# EAGLE schematic PCB (EAGLE 9.6.2)
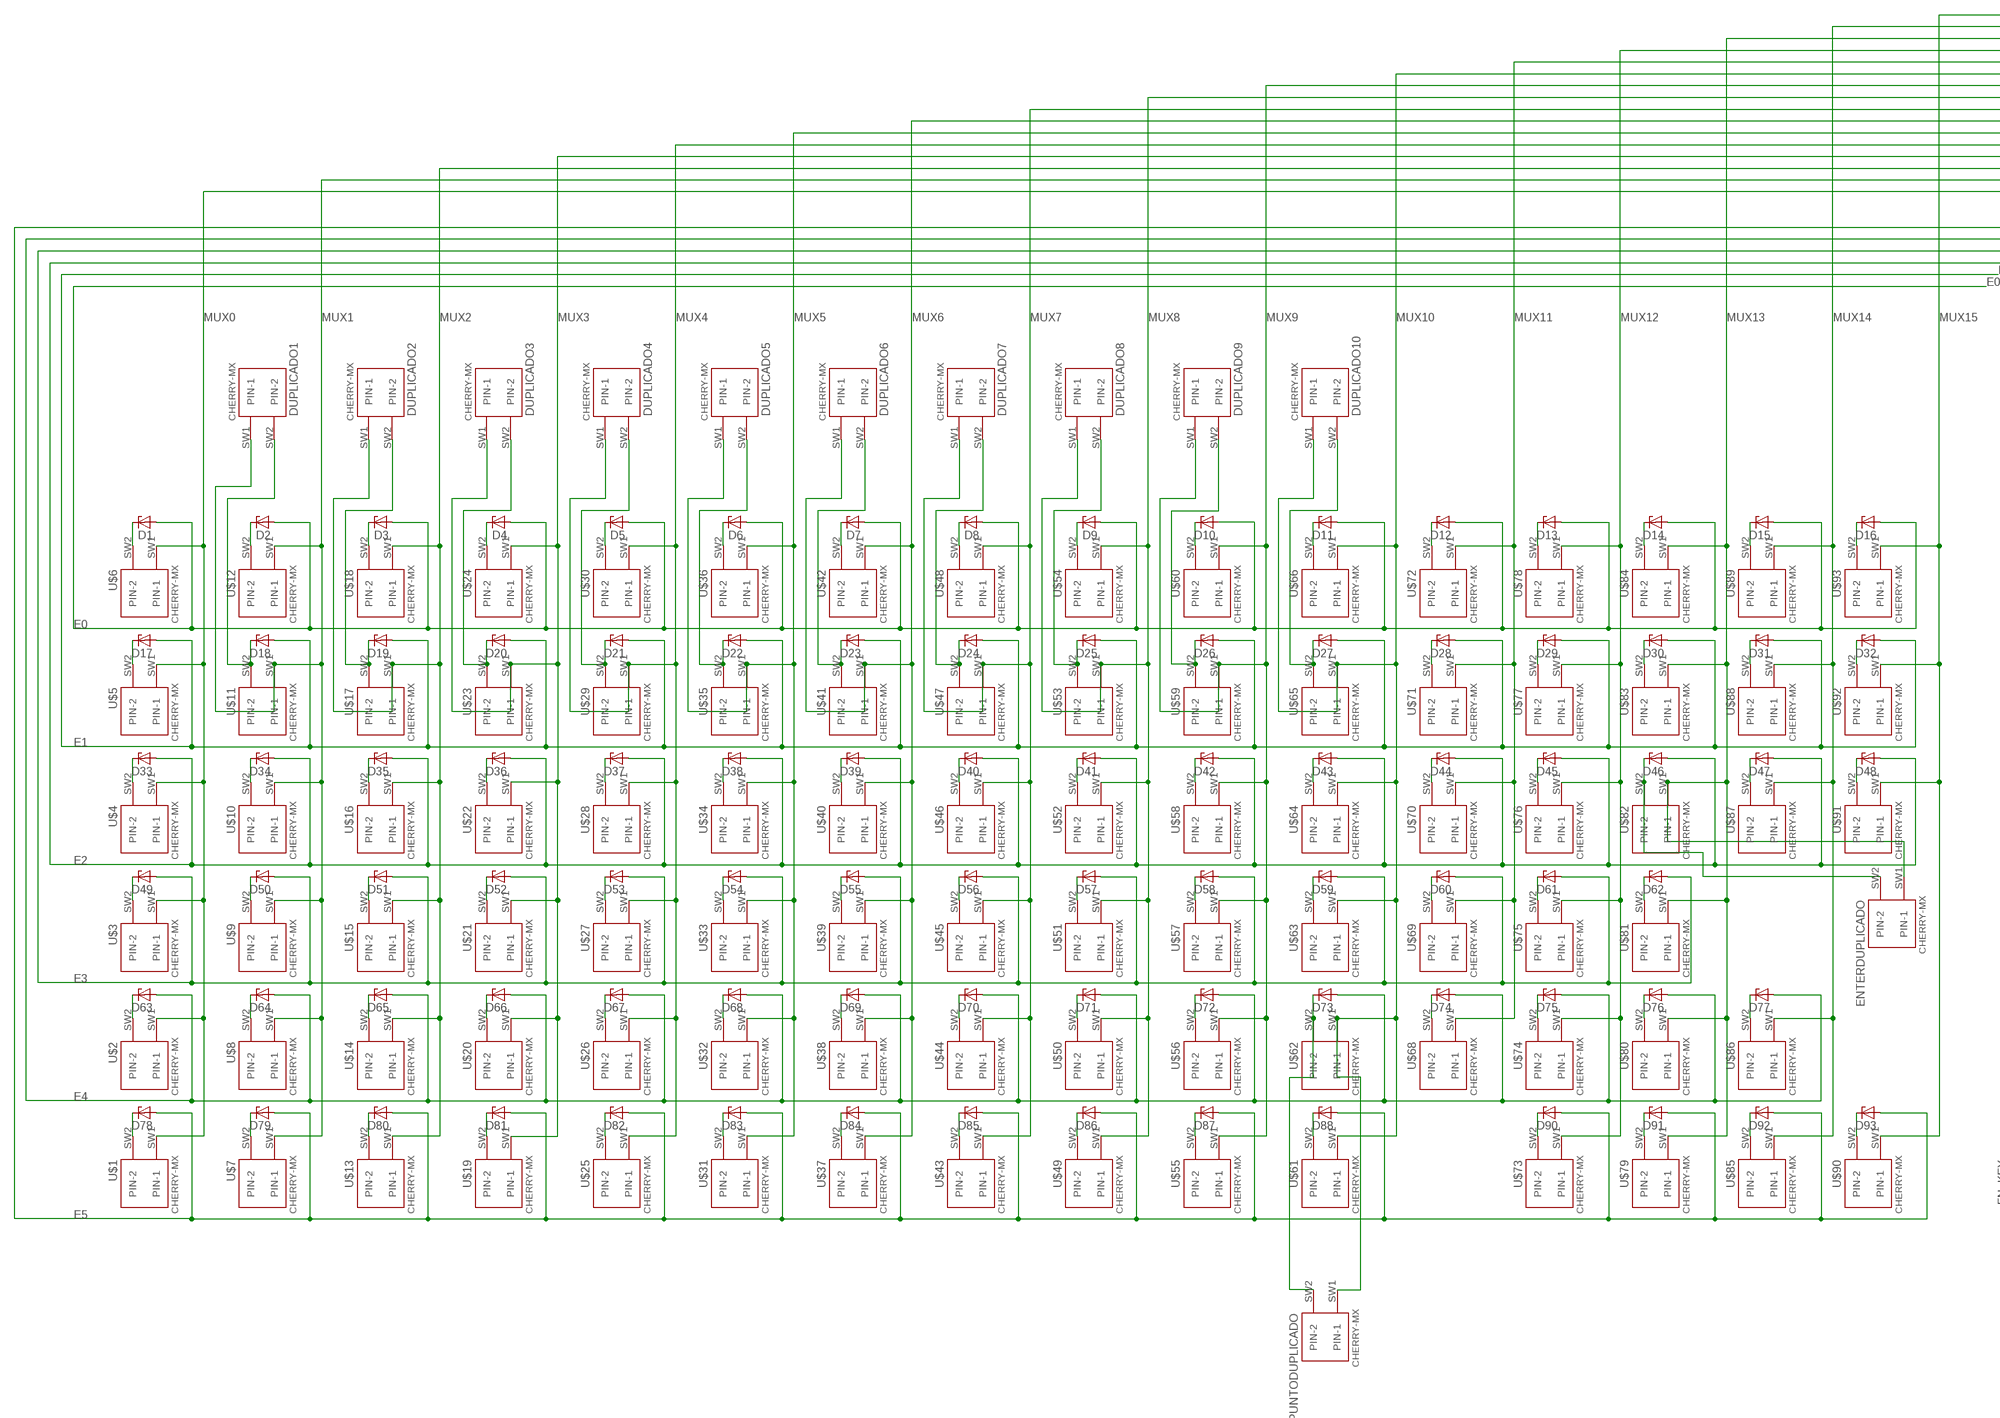
[diagram p0: schematic, sheet 1, part 1 of 2]
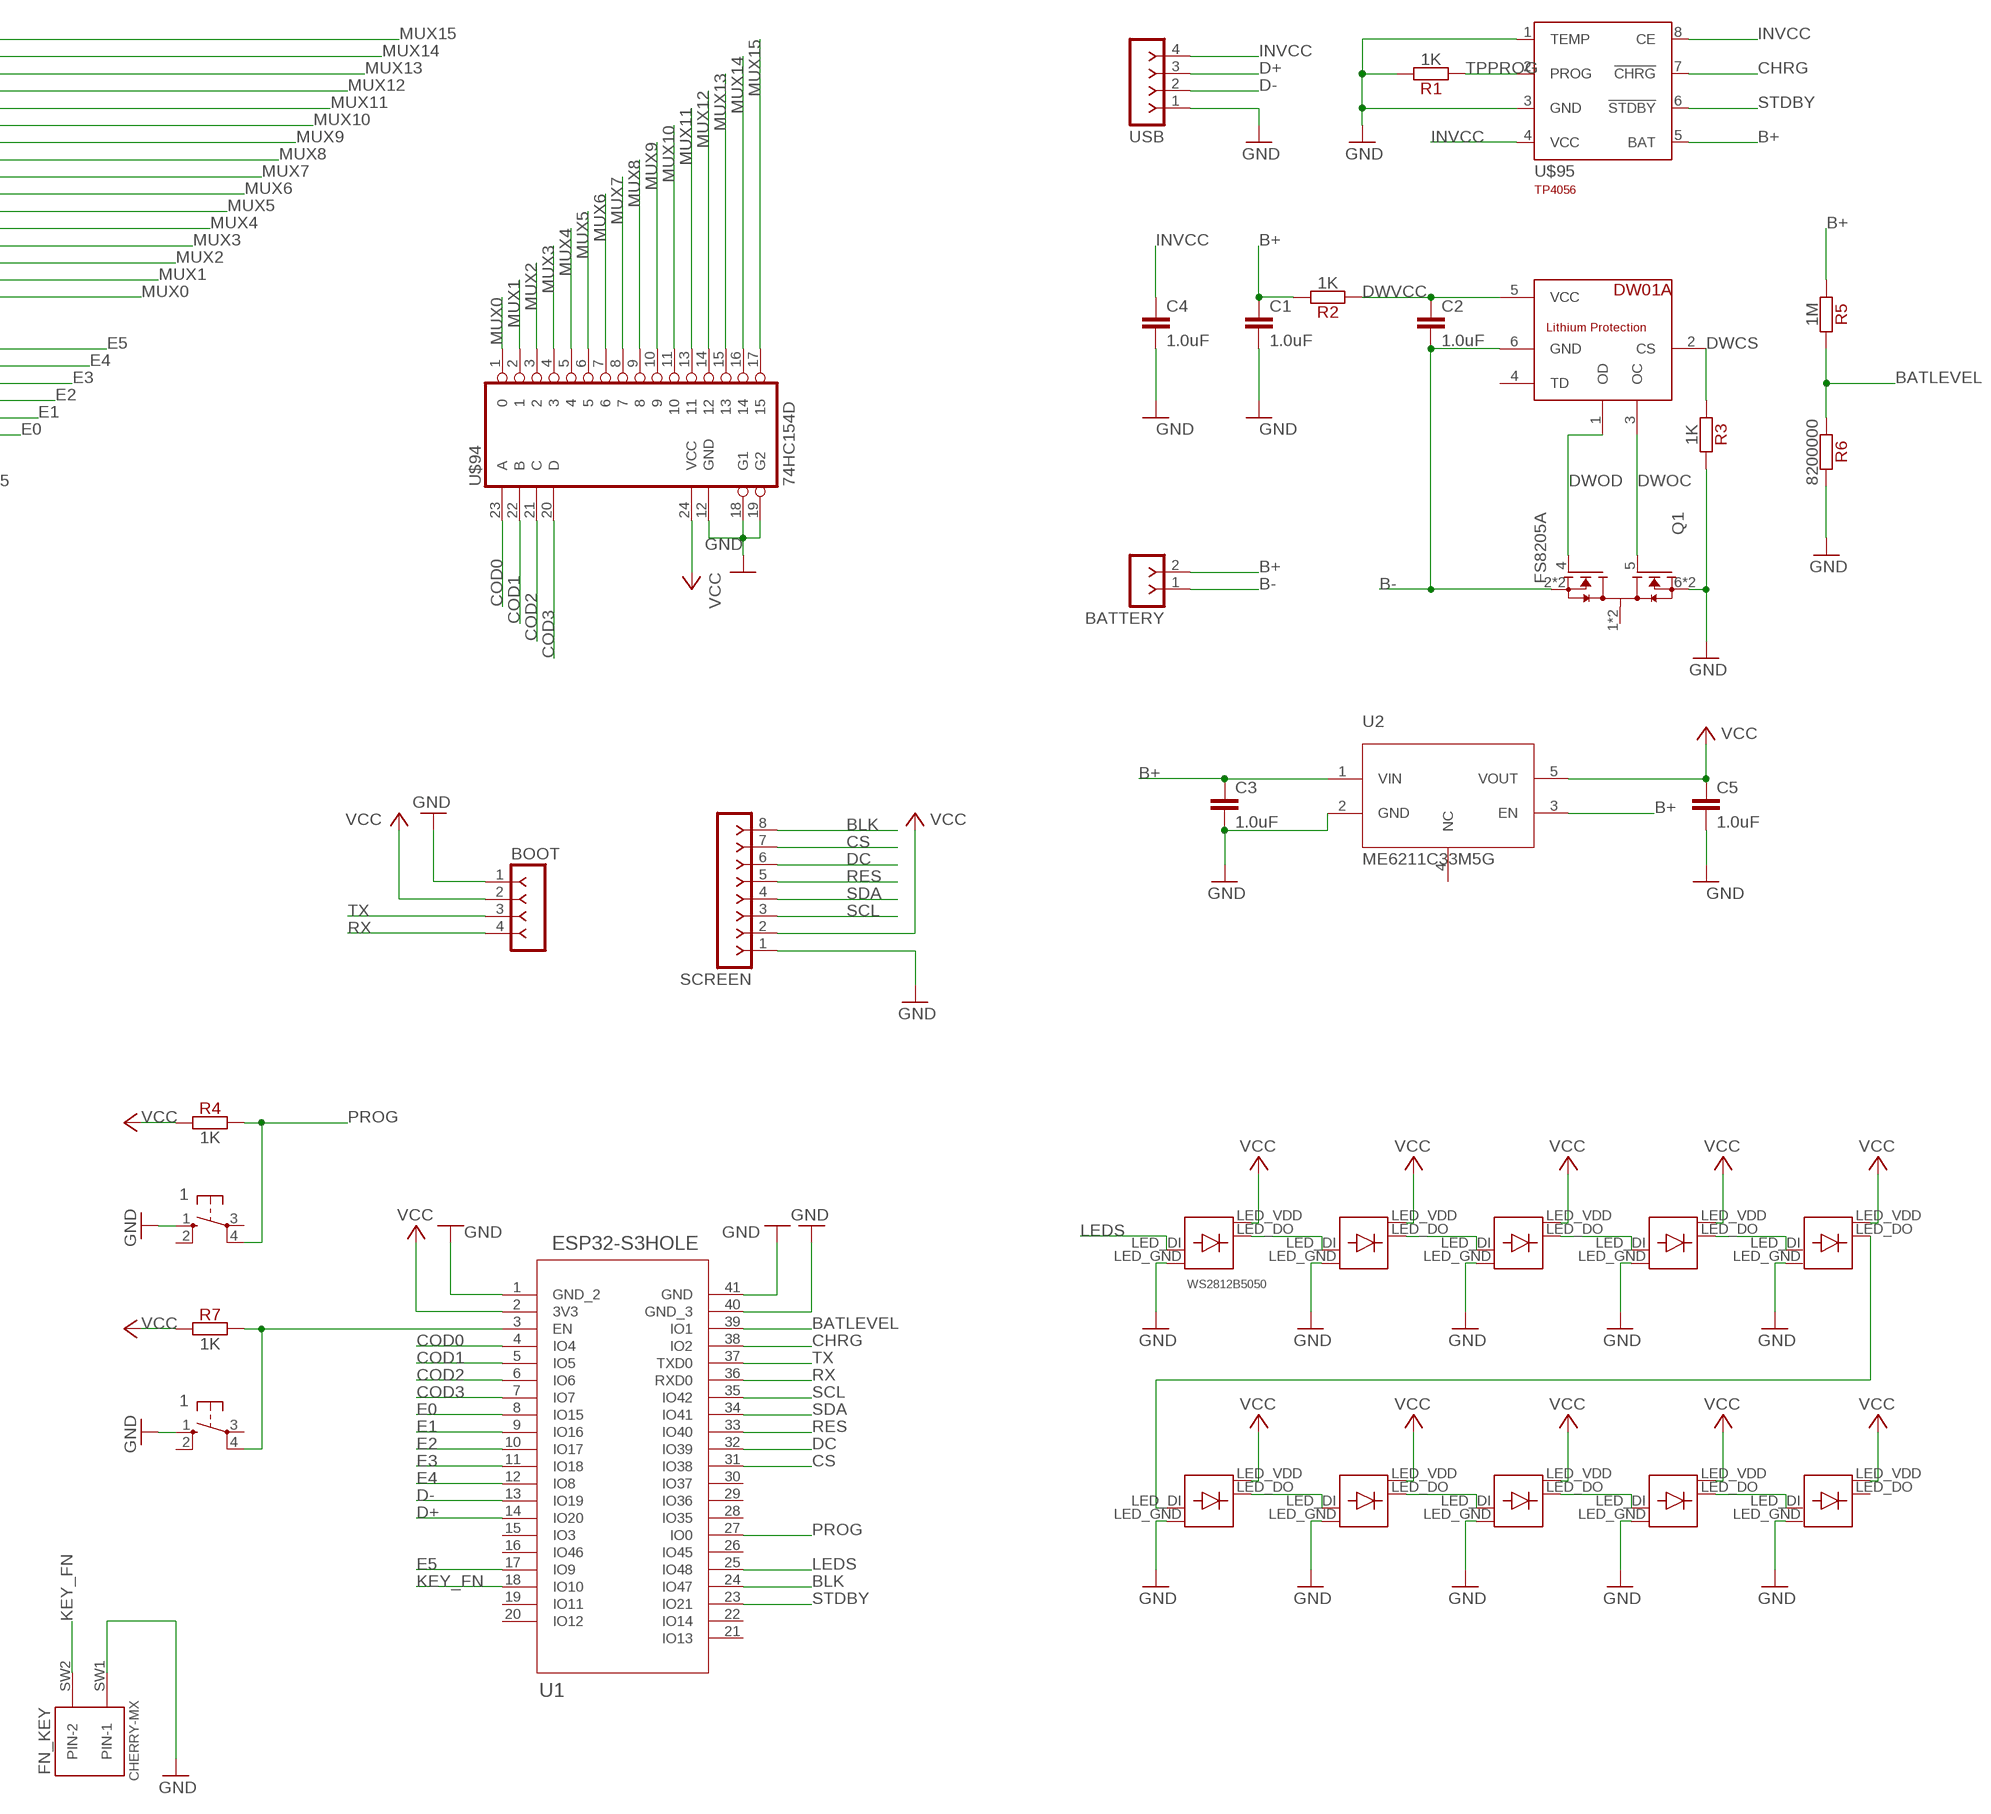
[diagram p1: schematic, sheet 1, part 2 of 2]

## Parts
BATTERY  F-1X02-SIP-100-40  [SIP-100-02-40]
BOOT  BOOT  F-1X04-SIP-100-32  [SIP-100-04-32]
BUTTON  1  10-XX  [B3F-10XX]
BUTTON1  1  10-XX  [B3F-10XX]
C1  1.0uF  1.0UF-1206-50V-10%  [1206]
C2  1.0uF  1.0UF-1206-50V-10%  [1206]
C3  1.0uF  1.0UF-1206-50V-10%  [1206]
C4  1.0uF  1.0UF-1206-50V-10%  [1206]
C5  1.0uF  1.0UF-1206-50V-10%  [1206]
D1  ZENER-DIODE-SOD123  [SOD123FL]
D2  ZENER-DIODE-SOD123  [SOD123FL]
D3  ZENER-DIODE-SOD123  [SOD123FL]
D4  ZENER-DIODE-SOD123  [SOD123FL]
D5  ZENER-DIODE-SOD123  [SOD123FL]
D6  ZENER-DIODE-SOD123  [SOD123FL]
D7  ZENER-DIODE-SOD123  [SOD123FL]
D8  ZENER-DIODE-SOD123  [SOD123FL]
D9  ZENER-DIODE-SOD123  [SOD123FL]
D10  ZENER-DIODE-SOD123  [SOD123FL]
D11  ZENER-DIODE-SOD123  [SOD123FL]
D12  ZENER-DIODE-SOD123  [SOD123FL]
D13  ZENER-DIODE-SOD123  [SOD123FL]
D14  ZENER-DIODE-SOD123  [SOD123FL]
D15  ZENER-DIODE-SOD123  [SOD123FL]
D16  ZENER-DIODE-SOD123  [SOD123FL]
D17  ZENER-DIODE-SOD123  [SOD123FL]
D18  ZENER-DIODE-SOD123  [SOD123FL]
D19  ZENER-DIODE-SOD123  [SOD123FL]
D20  ZENER-DIODE-SOD123  [SOD123FL]
D21  ZENER-DIODE-SOD123  [SOD123FL]
D22  ZENER-DIODE-SOD123  [SOD123FL]
D23  ZENER-DIODE-SOD123  [SOD123FL]
D24  ZENER-DIODE-SOD123  [SOD123FL]
D25  ZENER-DIODE-SOD123  [SOD123FL]
D26  ZENER-DIODE-SOD123  [SOD123FL]
D27  ZENER-DIODE-SOD123  [SOD123FL]
D28  ZENER-DIODE-SOD123  [SOD123FL]
D29  ZENER-DIODE-SOD123  [SOD123FL]
D30  ZENER-DIODE-SOD123  [SOD123FL]
D31  ZENER-DIODE-SOD123  [SOD123FL]
D32  ZENER-DIODE-SOD123  [SOD123FL]
D33  ZENER-DIODE-SOD123  [SOD123FL]
D34  ZENER-DIODE-SOD123  [SOD123FL]
D35  ZENER-DIODE-SOD123  [SOD123FL]
D36  ZENER-DIODE-SOD123  [SOD123FL]
D37  ZENER-DIODE-SOD123  [SOD123FL]
D38  ZENER-DIODE-SOD123  [SOD123FL]
D39  ZENER-DIODE-SOD123  [SOD123FL]
D40  ZENER-DIODE-SOD123  [SOD123FL]
D41  ZENER-DIODE-SOD123  [SOD123FL]
D42  ZENER-DIODE-SOD123  [SOD123FL]
D43  ZENER-DIODE-SOD123  [SOD123FL]
D44  ZENER-DIODE-SOD123  [SOD123FL]
D45  ZENER-DIODE-SOD123  [SOD123FL]
D46  ZENER-DIODE-SOD123  [SOD123FL]
D47  ZENER-DIODE-SOD123  [SOD123FL]
D48  ZENER-DIODE-SOD123  [SOD123FL]
D49  ZENER-DIODE-SOD123  [SOD123FL]
D50  ZENER-DIODE-SOD123  [SOD123FL]
D51  ZENER-DIODE-SOD123  [SOD123FL]
D52  ZENER-DIODE-SOD123  [SOD123FL]
D53  ZENER-DIODE-SOD123  [SOD123FL]
D54  ZENER-DIODE-SOD123  [SOD123FL]
D55  ZENER-DIODE-SOD123  [SOD123FL]
D56  ZENER-DIODE-SOD123  [SOD123FL]
D57  ZENER-DIODE-SOD123  [SOD123FL]
D58  ZENER-DIODE-SOD123  [SOD123FL]
D59  ZENER-DIODE-SOD123  [SOD123FL]
D60  ZENER-DIODE-SOD123  [SOD123FL]
D61  ZENER-DIODE-SOD123  [SOD123FL]
D62  ZENER-DIODE-SOD123  [SOD123FL]
D63  ZENER-DIODE-SOD123  [SOD123FL]
D64  ZENER-DIODE-SOD123  [SOD123FL]
D65  ZENER-DIODE-SOD123  [SOD123FL]
D66  ZENER-DIODE-SOD123  [SOD123FL]
D67  ZENER-DIODE-SOD123  [SOD123FL]
D68  ZENER-DIODE-SOD123  [SOD123FL]
D69  ZENER-DIODE-SOD123  [SOD123FL]
D70  ZENER-DIODE-SOD123  [SOD123FL]
D71  ZENER-DIODE-SOD123  [SOD123FL]
D72  ZENER-DIODE-SOD123  [SOD123FL]
D73  ZENER-DIODE-SOD123  [SOD123FL]
D74  ZENER-DIODE-SOD123  [SOD123FL]
D75  ZENER-DIODE-SOD123  [SOD123FL]
D76  ZENER-DIODE-SOD123  [SOD123FL]
D77  ZENER-DIODE-SOD123  [SOD123FL]
D78  ZENER-DIODE-SOD123  [SOD123FL]
D79  ZENER-DIODE-SOD123  [SOD123FL]
D80  ZENER-DIODE-SOD123  [SOD123FL]
D81  ZENER-DIODE-SOD123  [SOD123FL]
D82  ZENER-DIODE-SOD123  [SOD123FL]
D83  ZENER-DIODE-SOD123  [SOD123FL]
D84  ZENER-DIODE-SOD123  [SOD123FL]
D85  ZENER-DIODE-SOD123  [SOD123FL]
D86  ZENER-DIODE-SOD123  [SOD123FL]
D87  ZENER-DIODE-SOD123  [SOD123FL]
D88  ZENER-DIODE-SOD123  [SOD123FL]
D90  ZENER-DIODE-SOD123  [SOD123FL]
D91  ZENER-DIODE-SOD123  [SOD123FL]
D92  ZENER-DIODE-SOD123  [SOD123FL]
D93  ZENER-DIODE-SOD123  [SOD123FL]
DUPLICADO1  CHERRY-MX  [CHERRY-MX]
DUPLICADO2  CHERRY-MX  [CHERRY-MX]
DUPLICADO3  CHERRY-MX  [CHERRY-MX]
DUPLICADO4  CHERRY-MX  [CHERRY-MX]
DUPLICADO5  CHERRY-MX  [CHERRY-MX]
DUPLICADO6  CHERRY-MX  [CHERRY-MX]
DUPLICADO7  CHERRY-MX  [CHERRY-MX]
DUPLICADO8  CHERRY-MX  [CHERRY-MX]
DUPLICADO9  CHERRY-MX  [CHERRY-MX]
DUPLICADO10  CHERRY-MX  [CHERRY-MX]
ENTERDUPLICADO  CHERRY-MX  [CHERRY-MX]
FN_KEY  CHERRY-MX  [CHERRY-MX]
PUNTODUPLICADO  CHERRY-MX  [CHERRY-MX]
Q1  FS8205A  [SOP65P640X120-8N]
R1  1K  [R-0805]
R2  1K  [R-0805]
R3  1K  [R-0805]
R4  1K  [R-0805]
R5  1M  1K  [R-0805]
R6  8200000  1K  [R-0805]
R7  1K  [R-0805]
SCREEN  F-1X08-SIP-100-40  [SIP-100-08-40]
U1  ESP32-S3HOLE  [ESP32-S3HOLE]
U2  ME6211C33M5G  [ME6211C33M5G]
U$1  CHERRY-MX  [CHERRY-MX]
U$2  CHERRY-MX  [CHERRY-MX]
U$3  CHERRY-MX  [CHERRY-MX]
U$4  CHERRY-MX  [CHERRY-MX]
U$5  CHERRY-MX  [CHERRY-MX]
U$6  CHERRY-MX  [CHERRY-MX]
U$7  CHERRY-MX  [CHERRY-MX]
U$8  CHERRY-MX  [CHERRY-MX]
U$9  CHERRY-MX  [CHERRY-MX]
U$10  CHERRY-MX  [CHERRY-MX]
U$11  CHERRY-MX  [CHERRY-MX]
U$12  CHERRY-MX  [CHERRY-MX]
U$13  CHERRY-MX  [CHERRY-MX]
U$14  CHERRY-MX  [CHERRY-MX]
U$15  CHERRY-MX  [CHERRY-MX]
U$16  CHERRY-MX  [CHERRY-MX]
U$17  CHERRY-MX  [CHERRY-MX]
U$18  CHERRY-MX  [CHERRY-MX]
U$19  CHERRY-MX  [CHERRY-MX]
U$20  CHERRY-MX  [CHERRY-MX]
U$21  CHERRY-MX  [CHERRY-MX]
U$22  CHERRY-MX  [CHERRY-MX]
U$23  CHERRY-MX  [CHERRY-MX]
U$24  CHERRY-MX  [CHERRY-MX]
U$25  CHERRY-MX  [CHERRY-MX]
U$26  CHERRY-MX  [CHERRY-MX]
U$27  CHERRY-MX  [CHERRY-MX]
U$28  CHERRY-MX  [CHERRY-MX]
U$29  CHERRY-MX  [CHERRY-MX]
U$30  CHERRY-MX  [CHERRY-MX]
U$31  CHERRY-MX  [CHERRY-MX]
U$32  CHERRY-MX  [CHERRY-MX]
U$33  CHERRY-MX  [CHERRY-MX]
U$34  CHERRY-MX  [CHERRY-MX]
U$35  CHERRY-MX  [CHERRY-MX]
U$36  CHERRY-MX  [CHERRY-MX]
U$37  CHERRY-MX  [CHERRY-MX]
U$38  CHERRY-MX  [CHERRY-MX]
U$39  CHERRY-MX  [CHERRY-MX]
U$40  CHERRY-MX  [CHERRY-MX]
U$41  CHERRY-MX  [CHERRY-MX]
U$42  CHERRY-MX  [CHERRY-MX]
U$43  CHERRY-MX  [CHERRY-MX]
U$44  CHERRY-MX  [CHERRY-MX]
U$45  CHERRY-MX  [CHERRY-MX]
U$46  CHERRY-MX  [CHERRY-MX]
U$47  CHERRY-MX  [CHERRY-MX]
U$48  CHERRY-MX  [CHERRY-MX]
U$49  CHERRY-MX  [CHERRY-MX]
U$50  CHERRY-MX  [CHERRY-MX]
U$51  CHERRY-MX  [CHERRY-MX]
U$52  CHERRY-MX  [CHERRY-MX]
U$53  CHERRY-MX  [CHERRY-MX]
U$54  CHERRY-MX  [CHERRY-MX]
U$55  CHERRY-MX  [CHERRY-MX]
U$56  CHERRY-MX  [CHERRY-MX]
U$57  CHERRY-MX  [CHERRY-MX]
U$58  CHERRY-MX  [CHERRY-MX]
U$59  CHERRY-MX  [CHERRY-MX]
U$60  CHERRY-MX  [CHERRY-MX]
U$61  CHERRY-MX  [CHERRY-MX]
U$62  CHERRY-MX  [CHERRY-MX]
U$63  CHERRY-MX  [CHERRY-MX]
U$64  CHERRY-MX  [CHERRY-MX]
U$65  CHERRY-MX  [CHERRY-MX]
U$66  CHERRY-MX  [CHERRY-MX]
U$67  WS2812B5050  [WS2812B5050]
U$68  CHERRY-MX  [CHERRY-MX]
U$69  CHERRY-MX  [CHERRY-MX]
U$70  CHERRY-MX  [CHERRY-MX]
U$71  CHERRY-MX  [CHERRY-MX]
U$72  CHERRY-MX  [CHERRY-MX]
U$73  CHERRY-MX  [CHERRY-MX]
U$74  CHERRY-MX  [CHERRY-MX]
U$75  CHERRY-MX  [CHERRY-MX]
U$76  CHERRY-MX  [CHERRY-MX]
U$77  CHERRY-MX  [CHERRY-MX]
U$78  CHERRY-MX  [CHERRY-MX]
U$79  CHERRY-MX  [CHERRY-MX]
U$80  CHERRY-MX  [CHERRY-MX]
U$81  CHERRY-MX  [CHERRY-MX]
U$82  CHERRY-MX  [CHERRY-MX]
U$83  CHERRY-MX  [CHERRY-MX]
U$84  CHERRY-MX  [CHERRY-MX]
U$85  CHERRY-MX  [CHERRY-MX]
U$86  CHERRY-MX  [CHERRY-MX]
U$87  CHERRY-MX  [CHERRY-MX]
U$88  CHERRY-MX  [CHERRY-MX]
U$89  CHERRY-MX  [CHERRY-MX]
U$90  CHERRY-MX  [CHERRY-MX]
U$91  CHERRY-MX  [CHERRY-MX]
U$92  CHERRY-MX  [CHERRY-MX]
U$93  CHERRY-MX  [CHERRY-MX]
U$94  74HC154D  [74HC154D]
U$95  TP4056  [SOT23-8]
U$96  DW01A  [SOT23-6]
U$97  WS2812B5050  [WS2812B5050]
U$98  WS2812B5050  [WS2812B5050]
U$99  WS2812B5050  [WS2812B5050]
U$100  WS2812B5050  [WS2812B5050]
U$101  WS2812B5050  [WS2812B5050]
U$102  WS2812B5050  [WS2812B5050]
U$103  WS2812B5050  [WS2812B5050]
U$104  WS2812B5050  [WS2812B5050]
U$105  WS2812B5050  [WS2812B5050]
USB  F-1X04-SIP-100-32  [SIP-100-04-32]

## Nets
B+: BATTERY.2 C1.1 C3.1 R2.2 R5.1 U2.1(VIN) U2.3(EN) U$95.5(BAT)
B-: BATTERY.1 C2.2 Q1.2(S1) Q1.3(S1) U$96.6(GND)
BATLEVEL: R5.2 R6.1 U1.39(IO1)
BLK: SCREEN.8 U1.24(IO47)
CHRG: U1.38(IO2) U$95.7(!CHRG)
COD0: U1.4(IO4) U$94.23(A)
COD1: U1.5(IO5) U$94.22(B)
COD2: U1.6(IO6) U$94.21(C)
COD3: U1.7(IO7) U$94.20(D)
CS: SCREEN.7 U1.31(IO38)
D+: U1.14(IO20) USB.3
D-: U1.13(IO19) USB.2
DC: SCREEN.6 U1.32(IO39)
DWCS: R3.1 U$96.2(CS)
DWOC: Q1.5(G2) U$96.3(OC)
DWOD: Q1.4(G1) U$96.1(OD)
DWVCC: C2.1 R2.1 U$96.5(VCC)
E0: D1.A D2.A D3.A D4.A D5.A D6.A D7.A D8.A D9.A D10.A D11.A D12.A D13.A D14.A D15.A D16.A U1.8(IO15)
E1: D17.A D18.A D19.A D20.A D21.A D22.A D23.A D24.A D25.A D26.A D27.A D28.A D29.A D30.A D31.A D32.A U1.9(IO16)
E2: D33.A D34.A D35.A D36.A D37.A D38.A D39.A D40.A D41.A D42.A D43.A D44.A D45.A D46.A D47.A D48.A U1.10(IO17)
E3: D49.A D50.A D51.A D52.A D53.A D54.A D55.A D56.A D57.A D58.A D59.A D60.A D61.A D62.A U1.11(IO18)
E4: D63.A D64.A D65.A D66.A D67.A D68.A D69.A D70.A D71.A D72.A D73.A D74.A D75.A D76.A D77.A U1.12(IO8)
E5: D78.A D79.A D80.A D81.A D82.A D83.A D84.A D85.A D86.A D87.A D88.A D90.A D91.A D92.A D93.A U1.17(IO9)
EN: BUTTON1.4(P1) R7.2 U1.3(EN)
GND: BOOT.1 BUTTON1.1(S) BUTTON.1(S) C1.2 C3.2 C4.2 C5.2 FN_KEY.SW1(PIN-1) Q1.6(S2) Q1.7(S2) R1.2 R3.2 R6.2 SCREEN.1 U1.1(GND_2) U1.40(GND_3) U1.41(GND) U2.2(GND) U$67.LED_GND U$94.12(GND) U$94.18(G1) U$94.19(G2) U$95.1(TEMP) U$95.3(GND) U$97.LED_GND U$98.LED_GND U$99.LED_GND U$100.LED_GND U$101.LED_GND U$102.LED_GND U$103.LED_GND U$104.LED_GND U$105.LED_GND USB.1
INVCC: C4.1 U$95.4(VCC) U$95.8(CE) USB.4
KEY_FN: FN_KEY.SW2(PIN-2) U1.18(IO10)
LEDS: U1.25(IO48) U$67.LED_DI
MUX0 [Keys]: U$1.SW1(PIN-1) U$2.SW1(PIN-1) U$3.SW1(PIN-1) U$4.SW1(PIN-1) U$5.SW1(PIN-1) U$6.SW1(PIN-1) U$94.1
MUX1 [Keys]: DUPLICADO1.SW1(PIN-1) U$7.SW1(PIN-1) U$8.SW1(PIN-1) U$9.SW1(PIN-1) U$10.SW1(PIN-1) U$11.SW1(PIN-1) U$12.SW1(PIN-1) U$94.2
MUX2 [Keys]: DUPLICADO2.SW1(PIN-1) U$13.SW1(PIN-1) U$14.SW1(PIN-1) U$15.SW1(PIN-1) U$16.SW1(PIN-1) U$17.SW1(PIN-1) U$18.SW1(PIN-1) U$94.3
MUX3 [Keys]: DUPLICADO3.SW1(PIN-1) U$19.SW1(PIN-1) U$20.SW1(PIN-1) U$21.SW1(PIN-1) U$22.SW1(PIN-1) U$23.SW1(PIN-1) U$24.SW1(PIN-1) U$94.4
MUX4 [Keys]: DUPLICADO4.SW1(PIN-1) U$25.SW1(PIN-1) U$26.SW1(PIN-1) U$27.SW1(PIN-1) U$28.SW1(PIN-1) U$29.SW1(PIN-1) U$30.SW1(PIN-1) U$94.5
MUX5 [Keys]: DUPLICADO5.SW1(PIN-1) U$31.SW1(PIN-1) U$32.SW1(PIN-1) U$33.SW1(PIN-1) U$34.SW1(PIN-1) U$35.SW1(PIN-1) U$36.SW1(PIN-1) U$94.6
MUX6 [Keys]: DUPLICADO6.SW1(PIN-1) U$37.SW1(PIN-1) U$38.SW1(PIN-1) U$39.SW1(PIN-1) U$40.SW1(PIN-1) U$41.SW1(PIN-1) U$42.SW1(PIN-1) U$94.7
MUX7 [Keys]: DUPLICADO7.SW1(PIN-1) U$43.SW1(PIN-1) U$44.SW1(PIN-1) U$45.SW1(PIN-1) U$46.SW1(PIN-1) U$47.SW1(PIN-1) U$48.SW1(PIN-1) U$94.8
MUX8 [Keys]: DUPLICADO8.SW1(PIN-1) U$49.SW1(PIN-1) U$50.SW1(PIN-1) U$51.SW1(PIN-1) U$52.SW1(PIN-1) U$53.SW1(PIN-1) U$54.SW1(PIN-1) U$94.9
MUX9 [Keys]: DUPLICADO9.SW1(PIN-1) U$55.SW1(PIN-1) U$56.SW1(PIN-1) U$57.SW1(PIN-1) U$58.SW1(PIN-1) U$59.SW1(PIN-1) U$60.SW1(PIN-1) U$94.10
MUX10 [Keys]: DUPLICADO10.SW1(PIN-1) PUNTODUPLICADO.SW1(PIN-1) U$61.SW1(PIN-1) U$62.SW1(PIN-1) U$63.SW1(PIN-1) U$64.SW1(PIN-1) U$65.SW1(PIN-1) U$66.SW1(PIN-1) U$94.11
MUX11 [Keys]: U$68.SW1(PIN-1) U$69.SW1(PIN-1) U$70.SW1(PIN-1) U$71.SW1(PIN-1) U$72.SW1(PIN-1) U$94.13
MUX12 [Keys]: U$73.SW1(PIN-1) U$74.SW1(PIN-1) U$75.SW1(PIN-1) U$76.SW1(PIN-1) U$77.SW1(PIN-1) U$78.SW1(PIN-1) U$94.14
MUX13 [Keys]: ENTERDUPLICADO.SW1(PIN-1) U$79.SW1(PIN-1) U$80.SW1(PIN-1) U$81.SW1(PIN-1) U$82.SW1(PIN-1) U$83.SW1(PIN-1) U$84.SW1(PIN-1) U$94.15
MUX14 [Keys]: U$85.SW1(PIN-1) U$86.SW1(PIN-1) U$87.SW1(PIN-1) U$88.SW1(PIN-1) U$89.SW1(PIN-1) U$94.16
MUX15 [Keys]: U$90.SW1(PIN-1) U$91.SW1(PIN-1) U$92.SW1(PIN-1) U$93.SW1(PIN-1) U$94.17
N$1 [Keys]: D33.C U$4.SW2(PIN-2)
N$2 [Keys]: D34.C U$10.SW2(PIN-2)
N$3 [Keys]: D35.C U$16.SW2(PIN-2)
N$4 [Keys]: D36.C U$22.SW2(PIN-2)
N$5 [Keys]: D17.C U$5.SW2(PIN-2)
N$6 [Keys]: D1.C U$6.SW2(PIN-2)
N$7 [Keys]: D37.C U$28.SW2(PIN-2)
N$8 [Keys]: D38.C U$34.SW2(PIN-2)
N$9 [Keys]: D39.C U$40.SW2(PIN-2)
N$10 [Keys]: D40.C U$46.SW2(PIN-2)
N$11 [Keys]: D18.C DUPLICADO1.SW2(PIN-2) U$11.SW2(PIN-2)
N$12 [Keys]: D2.C U$12.SW2(PIN-2)
N$13 [Keys]: D41.C U$52.SW2(PIN-2)
N$14 [Keys]: D42.C U$58.SW2(PIN-2)
N$15 [Keys]: D43.C U$64.SW2(PIN-2)
N$16 [Keys]: D44.C U$70.SW2(PIN-2)
N$17 [Keys]: D19.C DUPLICADO2.SW2(PIN-2) U$17.SW2(PIN-2)
N$18 [Keys]: D3.C U$18.SW2(PIN-2)
N$19 [Keys]: D45.C U$76.SW2(PIN-2)
N$20 [Keys]: D47.C U$87.SW2(PIN-2)
N$21 [Keys]: D48.C U$91.SW2(PIN-2)
N$22 [Keys]: D62.C U$81.SW2(PIN-2)
N$23 [Keys]: D20.C DUPLICADO3.SW2(PIN-2) U$23.SW2(PIN-2)
N$24 [Keys]: D4.C U$24.SW2(PIN-2)
N$25 [Keys]: D61.C U$75.SW2(PIN-2)
N$26 [Keys]: D60.C U$69.SW2(PIN-2)
N$27 [Keys]: D59.C U$63.SW2(PIN-2)
N$28 [Keys]: D58.C U$57.SW2(PIN-2)
N$29 [Keys]: D21.C DUPLICADO4.SW2(PIN-2) U$29.SW2(PIN-2)
N$30 [Keys]: D5.C U$30.SW2(PIN-2)
N$35 [Keys]: U$97.LED_DO U$98.LED_DI
N$37 [Keys]: D57.C U$51.SW2(PIN-2)
N$38 [Keys]: D56.C U$45.SW2(PIN-2)
N$39 [Keys]: D55.C U$39.SW2(PIN-2)
N$40 [Keys]: D54.C U$33.SW2(PIN-2)
N$41 [Keys]: D22.C DUPLICADO5.SW2(PIN-2) U$35.SW2(PIN-2)
N$42 [Keys]: D6.C U$36.SW2(PIN-2)
N$43 [Keys]: D53.C U$27.SW2(PIN-2)
N$44 [Keys]: D52.C U$21.SW2(PIN-2)
N$45 [Keys]: D51.C U$15.SW2(PIN-2)
N$46 [Keys]: D50.C U$9.SW2(PIN-2)
N$47 [Keys]: D23.C DUPLICADO6.SW2(PIN-2) U$41.SW2(PIN-2)
N$48 [Keys]: D7.C U$42.SW2(PIN-2)
N$49 [Keys]: D49.C U$3.SW2(PIN-2)
N$50 [Keys]: D63.C U$2.SW2(PIN-2)
N$51 [Keys]: D64.C U$8.SW2(PIN-2)
N$52 [Keys]: D65.C U$14.SW2(PIN-2)
N$53 [Keys]: D24.C DUPLICADO7.SW2(PIN-2) U$47.SW2(PIN-2)
N$54 [Keys]: D8.C U$48.SW2(PIN-2)
N$55 [Keys]: D66.C U$20.SW2(PIN-2)
N$56 [Keys]: D67.C U$26.SW2(PIN-2)
N$57 [Keys]: D68.C U$32.SW2(PIN-2)
N$58 [Keys]: D69.C U$38.SW2(PIN-2)
N$59 [Keys]: D25.C DUPLICADO8.SW2(PIN-2) U$53.SW2(PIN-2)
N$60 [Keys]: D9.C U$54.SW2(PIN-2)
N$61 [Keys]: D70.C U$44.SW2(PIN-2)
N$62 [Keys]: D71.C U$50.SW2(PIN-2)
N$63 [Keys]: D72.C U$56.SW2(PIN-2)
N$64 [Keys]: D74.C U$68.SW2(PIN-2)
N$65 [Keys]: D26.C DUPLICADO9.SW2(PIN-2) U$59.SW2(PIN-2)
N$66 [Keys]: D10.C U$60.SW2(PIN-2)
N$67 [Keys]: D75.C U$74.SW2(PIN-2)
N$68 [Keys]: D73.C PUNTODUPLICADO.SW2(PIN-2) U$62.SW2(PIN-2)
N$69 [Keys]: D76.C U$80.SW2(PIN-2)
N$70 [Keys]: D77.C U$86.SW2(PIN-2)
N$71 [Keys]: D27.C DUPLICADO10.SW2(PIN-2) U$65.SW2(PIN-2)
N$72 [Keys]: D11.C U$66.SW2(PIN-2)
N$73 [Keys]: D93.C U$90.SW2(PIN-2)
N$74 [Keys]: D92.C U$85.SW2(PIN-2)
N$75 [Keys]: D91.C U$79.SW2(PIN-2)
N$76 [Keys]: D90.C U$73.SW2(PIN-2)
N$77 [Keys]: D28.C U$71.SW2(PIN-2)
N$78 [Keys]: D12.C U$72.SW2(PIN-2)
N$79 [Keys]: U$98.LED_DO U$99.LED_DI
N$80 [Keys]: D88.C U$61.SW2(PIN-2)
N$81 [Keys]: D87.C U$55.SW2(PIN-2)
N$82 [Keys]: D86.C U$49.SW2(PIN-2)
N$83 [Keys]: D29.C U$77.SW2(PIN-2)
N$84 [Keys]: D13.C U$78.SW2(PIN-2)
N$85 [Keys]: D85.C U$43.SW2(PIN-2)
N$86 [Keys]: D84.C U$37.SW2(PIN-2)
N$87 [Keys]: D83.C U$31.SW2(PIN-2)
N$88 [Keys]: D46.C ENTERDUPLICADO.SW2(PIN-2) U$82.SW2(PIN-2)
N$89 [Keys]: D30.C U$83.SW2(PIN-2)
N$90 [Keys]: D14.C U$84.SW2(PIN-2)
N$91 [Keys]: D82.C U$25.SW2(PIN-2)
N$92 [Keys]: D81.C U$19.SW2(PIN-2)
N$93 [Keys]: D80.C U$13.SW2(PIN-2)
N$94 [Keys]: D31.C U$88.SW2(PIN-2)
N$95 [Keys]: D15.C U$89.SW2(PIN-2)
N$96 [Keys]: D79.C U$7.SW2(PIN-2)
N$97 [Keys]: D78.C U$1.SW2(PIN-2)
N$98 [Keys]: D32.C U$92.SW2(PIN-2)
N$99 [Keys]: D16.C U$93.SW2(PIN-2)
N$100 [Keys]: U$99.LED_DO U$100.LED_DI
N$101 [Keys]: U$100.LED_DO U$101.LED_DI
N$102 [Keys]: U$101.LED_DO U$102.LED_DI
N$103 [Keys]: U$102.LED_DO U$103.LED_DI
N$104 [Keys]: U$103.LED_DO U$104.LED_DI
N$105 [Keys]: U$104.LED_DO U$105.LED_DI
N$106 [Keys]: U$67.LED_DO U$97.LED_DI
PROG: BUTTON.4(P1) R4.2 U1.27(IO0)
RES: SCREEN.5 U1.33(IO40)
RX: BOOT.4 U1.36(RXD0)
SCL: SCREEN.3 U1.35(IO42)
SDA: SCREEN.4 U1.34(IO41)
STDBY: U1.23(IO21) U$95.6(!STDBY)
TPPROG: R1.1 U$95.2(PROG)
TX: BOOT.3 U1.37(TXD0)
VCC: BOOT.2 C5.1 R4.1 R7.1 SCREEN.2 U1.2(3V3) U2.5(VOUT) U$67.LED_VDD U$94.24(VCC) U$97.LED_VDD U$98.LED_VDD U$99.LED_VDD U$100.LED_VDD U$101.LED_VDD U$102.LED_VDD U$103.LED_VDD U$104.LED_VDD U$105.LED_VDD
Unconnected: BUTTON1.2(S1) BUTTON1.3(P) BUTTON.2(S1) BUTTON.3(P) Q1.1(D12) Q1.8(D12) U1.15(IO3) U1.16(IO46) U1.19(IO11) U1.20(IO12) U1.21(IO13) U1.22(IO14) U1.26(IO45) U1.28(IO35) U1.29(IO36) U1.30(IO37) U2.4(NC) U$96.4(TD) U$105.LED_DO

## Library data of the parts
BATTERY = con-headers-jp:F-1X02-: FEMALE HEADER
BOOT USB = con-headers-jp:F-1X04-: FEMALE HEADER
BUTTON BUTTON1 = switch-omron:10-XX: OMRON SWITCH; MPN: B3F-1000; OC_FARNELL: 176432; OC_NEWARK: 36M3542
C1-C5 = SparkFun-Capacitors:1.0UF: 1µF ceramic capacitors A capacitor is a passive two-terminal electrical component used to store electrical energy temporarily in an electric field.; PROD_ID: CAP-09822
D1-D88 D90-D93 = bt_diode:ZENER-DIODE: Generic Zener diode
DUPLICADO1-DUPLICADO10 ENTERDUPLICADO FN_KEY PUNTODUPLICADO U$1-U$66 U$68-U$93 = cherrymx:CHERRY-MX: Cherry MX series keyswitch
Q1 = FS8205A:FS8205A: N/A Check availability <https://pricing.snapeda.com/parts/FS8205A/Fortune%20Semiconductor/view-part?ref=eda>; AVAILABILITY: Not in stock; CHECK_PRICES: https://www.snapeda.com/parts/FS8205A/Fortune+Semiconductor/view-part/?ref=eda; MF: Fortune Semiconductor; MP: FS8205A; PACKAGE: Package; PRICE: None; SNAPEDA_LINK: https://www.snapeda.com/parts/FS8205A/Fortune+Semiconductor/view-part/?ref=snap
R1-R7 = resistors:?; MOUSER: 660-RK73H2ATTD1001F
SCREEN = con-headers-jp:F-1X08-: FEMALE HEADER
U1 = Esp32S3-Hole:ESP32-S3HOLE; COPYRIGHT: Copyright (C) 2023 Ultra Librarian. All rights reserved.; MANUFACTURER_PART_NUMBER: ESP32-S3-WROOM-1-N8; MFR_NAME: Espressif Systems
U2 = ME6211:ME6211C33M5G; COPYRIGHT: Copyright (C) 2023 Ultra Librarian. All rights reserved.; MANUFACTURER_PART_NUMBER: RT9080-33GJ5; MFR_NAME: Richtek Technology
U$67 U$97-U$105 = Led-WS2812B:WS2812B5050
U$94 = 74HC154D 653:74HC154D
U$95 = TP4056:TP4056: TP4056 Data sheet <http://goo.gl/J7k8TF> Dave.Calaway Eagle Library <https://goo.gl/Muy1Tr>
U$96 = DW01A:DW01A

## Net classes
0 default: width 0.203 mm